# EasyEDA Pro project 无刷电调_V3.1.epro, board 无刷电调_V3.1
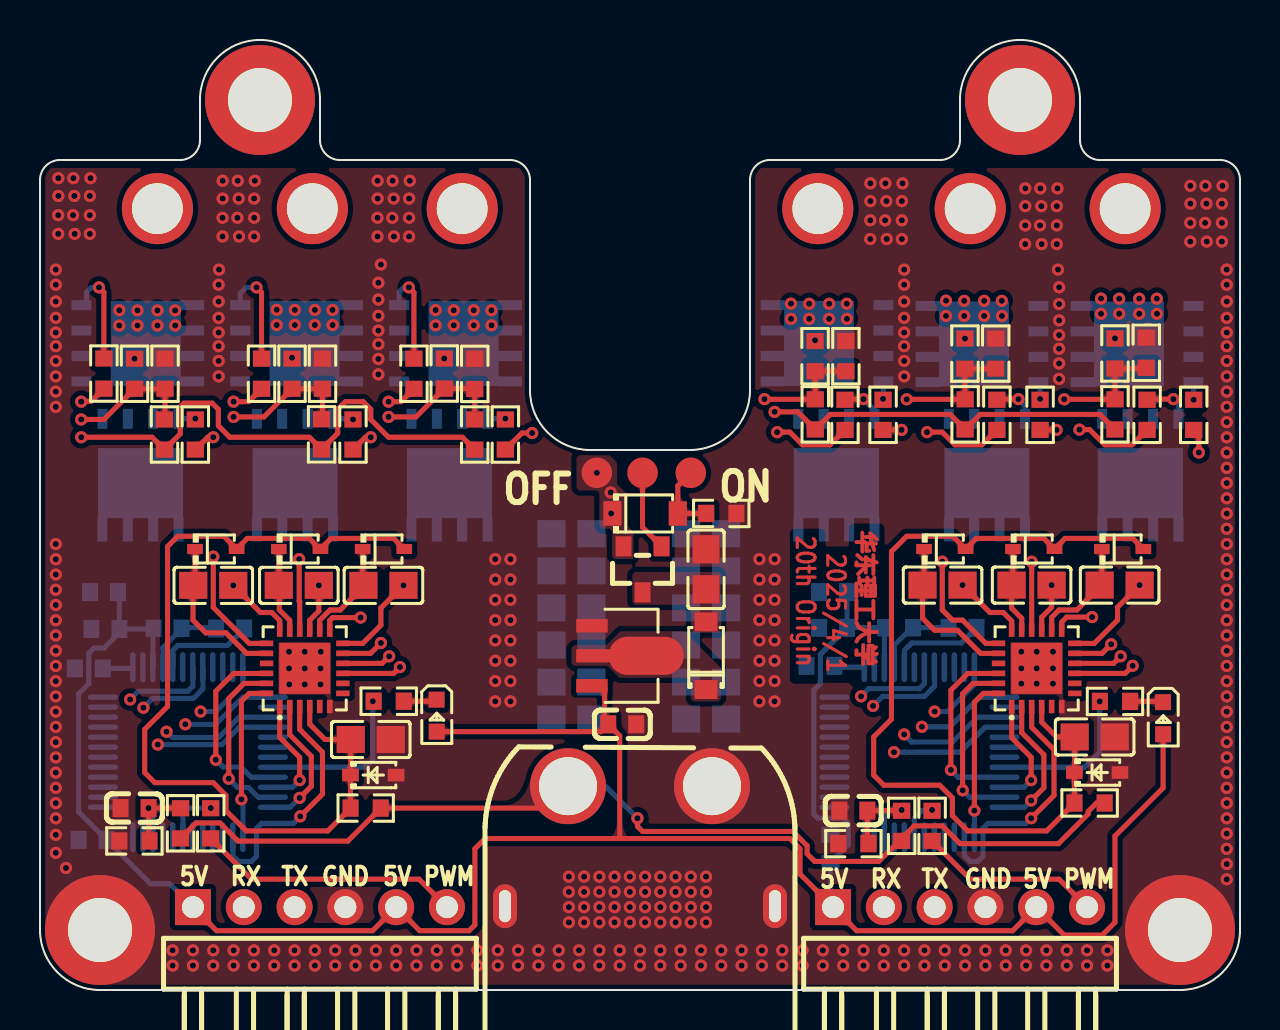
[diagram p4: board, top side]
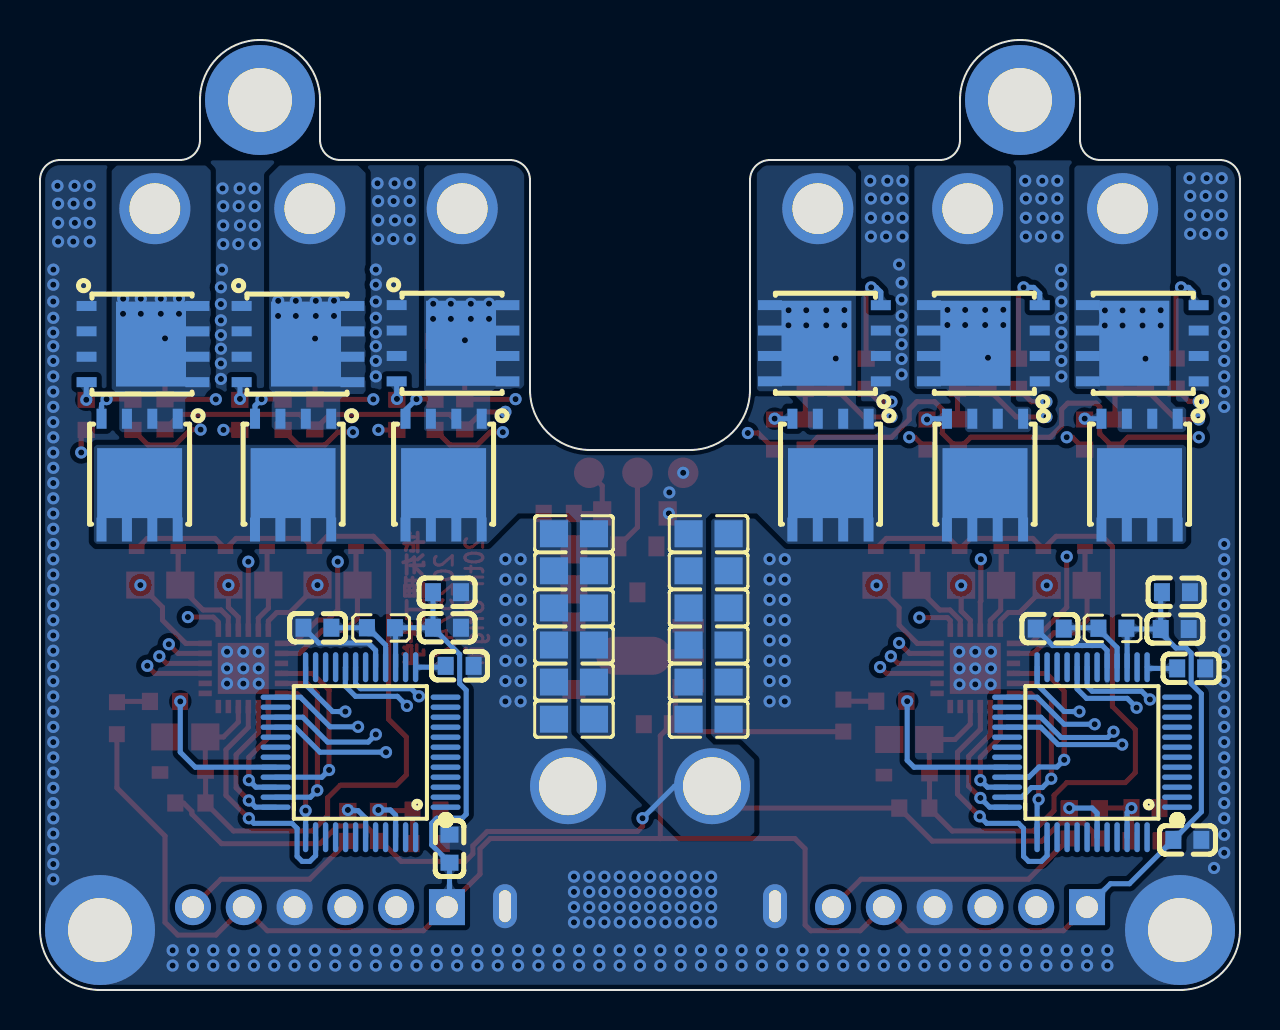
[diagram p5: board, bottom side, seen from below]

Outline 60 x 47.5 mm; copper layers: Top Layer, Inner1, Inner2, Bottom Layer. Coordinates in mm from the lower left corner of the outline.
Outline path: 0,40.5 0,3 arc(0.88,0.88) 3,0 57,0 arc(59.12,0.88) 60,3 60,40.5 arc(59.71,41.21) 59,41.5 53,41.5 arc(52.29,41.79) 52,42.5 52,44.51 arc(51.12,46.62) 49.01,47.5 48.99,47.5 arc(46.88,46.62) 46,44.51 46,42.5 arc(45.71,41.79) 45,41.5 36.5,41.5 arc(35.79,41.21) 35.5,40.5 35.5,30 arc(34.62,27.88) 32.5,27 27.5,27 arc(25.38,27.88) 24.5,30 24.5,40.5 arc(24.21,41.21) 23.5,41.5 15,41.5 arc(14.29,41.79) 14,42.5 14,44.51 arc(13.12,46.62) 11.01,47.5 10.99,47.5 arc(8.88,46.62) 8,44.51 8,42.5 arc(7.71,41.79) 7,41.5 1,41.5 arc(0.29,41.21) 0,40.5
Stack: Top Layer 0.035mm 外层铜厚1oz / Dielectric1 0.2104mm 7628 RC49% 8.6mil / Inner1 0.0152mm 内层铜厚 / Dielectric2 1.065mm 1.1mm H/HOZ Copper / Inner2 0.0152mm 内层铜厚 / Dielectric3 0.2104mm 7628 RC49% 8.6mil / Bottom Layer 0.035mm 外层铜厚1oz

## Design rules (mm)
template: 4层
spacing copperThickness1oz (default): track to track 0.102, other pairs 0.152 to 0.3
spacing copperThickness2oz: track to track 0.203, other pairs 0.152 to 0.3
spacing copperThicknessInner0.5oz: track to track 0.089, other pairs 0.152 to 0.3
spacing 板框0间距: track to track 0.152, other pairs 0 to 0.3
track width copperThickness1oz (default): min 0.102, default 0.254, max 2.54
track width copperThickness2oz: min 0.203, default 0.254, max 2.54
track width copperThickness0.5oz: min 0.089, default 0.254, max 2.54
differential pair differentialPair (default): width min 0.127, default 0.254, max 2.54; gap min 0.152, default 0.152
via viaSize (default): diameter min 0.3, default 0.61, max 10; hole min 0.2, default 0.305, max 6.3
region e112 uses copperRegion, copperThickness1oz, differentialPair, innerPlane, otherClearance, viaSize, 板框0间距
region e113 uses copperRegion, copperThickness1oz, differentialPair, innerPlane, otherClearance, viaSize, 板框0间距
region e114 uses 板框0间距
region e115 uses 板框0间距

## Placement (name value [footprint] x y rotation side)
C1  100nF  [C0603]  2.44 16.08 180 bottom
C2  10uF  [C0603]  2.63 7.51 0 bottom
C3  100nF  [C0603]  3.2 19.89 0 bottom
C4  100nF  [C0603]  9.51 18.07 0 bottom
C5  100nF  [C0603]  4.73 9.1 0 top
C6  22uF  [C0805]  26.57 13.54 0 bottom
C7  22uF  [C0805]  26.57 15.39 0 bottom
C8  22uF  [C0805]  26.57 17.25 0 bottom
C9  22uF  [C0805]  26.57 19.1 0 bottom
C10  22uF  [C0805]  26.57 22.81 0 bottom
C11  22uF  [C0805]  26.57 20.96 0 bottom
C12  22uF  [C0805]  33.3 21.03 270 top
C13  10uF  [C0603]  29.11 13.29 180 top
C14  100nF  [C0603]  3.27 18.05 0 bottom
C15  22uF  [C0805]  16.54 12.53 0 top
C16  4.7uF  [C0805]  8.66 20.23 0 top
C17  4.7uF  [C0805]  12.94 20.23 0 top
C18  4.7uF  [C0805]  17.17 20.23 0 top
C19  100nF  [C0603]  39.02 16.21 180 bottom
C20  10uF  [C0603]  39.65 18.11 0 bottom
C21  100nF  [C0603]  39.65 19.89 0 bottom
C22  100nF  [C0603]  46.13 18.11 0 bottom
C23  100nF  [C0603]  40.67 8.97 0 top
C24  22uF  [C0805]  33.3 13.54 180 bottom
C25  22uF  [C0805]  33.3 22.81 180 bottom
C26  22uF  [C0805]  33.3 20.96 180 bottom
C27  22uF  [C0805]  33.3 19.1 180 bottom
C28  22uF  [C0805]  33.3 17.25 180 bottom
C29  22uF  [C0805]  33.3 15.39 180 bottom
C33  22uF  [C0805]  52.73 12.65 0 top
C34  4.7uF  [C0805]  45.13 20.25 0 top
C35  4.7uF  [C0805]  49.58 20.25 0 top
C36  4.7uF  [C0805]  53.98 20.25 0 top
C37  100nF  [C0603]  39.53 7.06 270 bottom
CN1  XT60PW-M  [CONN-TH_XT60PW-M]  30 7.19 90 top
D1  BZT52C15S  [SOD-323_L1.7-W1.3-LS2.6-RD]  16.66 10.75 0 top
D2  B5819WS  [SOD-323_L1.7-W1.3-LS2.5-FD]  8.79 22.05 180 top
D3  B5819WS  [SOD-323_L1.7-W1.3-LS2.5-FD]  12.98 22.05 180 top
D4  B5819WS  [SOD-323_L1.7-W1.3-LS2.5-FD]  17.17 22.05 180 top
D5  DSK34  [SOD-123_L2.8-W1.8-LS3.7-RD]  33.3 16.72 90 top
D6  BZT52C15S  [SOD-323_L1.7-W1.3-LS2.6-RD]  52.86 10.87 0 top
D7  B5819WS  [SOD-323_L1.7-W1.3-LS2.5-FD]  45.24 22.05 180 top
D8  B5819WS  [SOD-323_L1.7-W1.3-LS2.5-FD]  49.69 22.05 180 top
D9  B5819WS  [SOD-323_L1.7-W1.3-LS2.5-FD]  54.13 22.05 180 top
D10  BZT52C16  [SOD-123_L2.7-W1.6-LS3.7-RD]  30.25 23.83 0 top
H1  PZ254R-11-06P  [HDR-TH_6P-P2.54-H-M-W10.4]  14 4.14 0 top
H3  PZ254R-11-06P  [HDR-TH_6P-P2.54-H-M-W10.4]  46 4.14 0 top
L1  CBG160808U000T  [L0603]  6.38 18.09 0 bottom
L2  CBG160808U000T  [L0603]  42.95 18.11 0 bottom
LED1  -  [LED_0603]  19.84 13.67 270 top
LED2  -  [LED_0603]  56.16 13.54 270 top
NOREF  -  [Pad_e760]  21.11 39.07 0 top
NOREF#2  -  [Pad_e761]  38.89 39.07 0 top
NOREF#3  -  [Pad_e34]  30.13 25.86 0 top
NOREF#4  -  [Pad_e757]  5.87 39.07 0 top
NOREF#5  -  [Pad_e763]  54.26 39.07 0 top
NOREF#6  -  [Pad_e762]  46.51 39.07 0 top
NOREF#7  -  [Pad_e131]  32.54 25.86 0 top
NOREF#8  -  [Pad_e759]  13.62 39.07 0 top
NOREF#9  -  [Pad_e130]  27.84 25.86 0 top
Q1  TPH1R403NL  [DSOP-8_L5.0-W5.0-P1.27-LS6.0-BL-EP]  5.02 25.79 0 bottom
Q2  TPH1R403NL  [DSOP-8_L5.0-W5.0-P1.27-LS6.0-BL-EP]  4.84 32.34 90 bottom
Q3  TPH1R403NL  [DSOP-8_L5.0-W5.0-P1.27-LS6.0-BL-EP]  12.75 25.79 0 bottom
Q4  TPH1R403NL  [DSOP-8_L5.0-W5.0-P1.27-LS6.0-BL-EP]  12.78 32.34 90 bottom
Q5  TPH1R403NL  [DSOP-8_L5.0-W5.0-P1.27-LS6.0-BL-EP]  20.47 25.79 0 bottom
Q6  TPH1R403NL  [DSOP-8_L5.0-W5.0-P1.27-LS6.0-BL-EP]  20.73 32.34 90 bottom
Q7  TPH1R403NL  [DSOP-8_L5.0-W5.0-P1.27-LS6.0-BL-EP]  39.82 25.79 0 bottom
Q8  TPH1R403NL  [DSOP-8_L5.0-W5.0-P1.27-LS6.0-BL-EP]  39.4 32.34 270 bottom
Q9  TPH1R403NL  [DSOP-8_L5.0-W5.0-P1.27-LS6.0-BL-EP]  47.34 25.79 0 bottom
Q10  TPH1R403NL  [DSOP-8_L5.0-W5.0-P1.27-LS6.0-BL-EP]  47.15 32.3 270 bottom
Q11  TPH1R403NL  [DSOP-8_L5.0-W5.0-P1.27-LS6.0-BL-EP]  55.02 25.79 0 bottom
Q12  TPH1R403NL  [DSOP-8_L5.0-W5.0-P1.27-LS6.0-BL-EP]  54.9 32.3 270 bottom
Q13  -  [AO3401A_SOT-23-3]  30.13 21.03 90 top
R2  5.1K  [R0603]  4.73 30.81 90 top
R3  1K  [R0603]  6.22 27.77 270 top
R4  5.1K  [R0603]  12.6 30.81 90 top
R5  1K  [R0603]  14.08 27.78 270 top
R6  5.1K  [R0603]  20.21 30.82 90 top
R7  1K  [R0603]  21.74 27.77 270 top
R8  1K  [R0603]  6.25 30.81 270 top
R9  1K  [R0603]  14.12 30.81 270 top
R10  1K  [R0603]  21.74 30.8 270 top
R11  47K  [R0603]  7.03 8.33 270 top
R12  10K  [R0603]  4.72 7.45 0 top
R13  100R  [R0603]  8.54 8.33 270 top
R14  10K  [R0603]  17.44 14.44 180 top
R15  100R  [R0603]  16.28 9.1 180 top
R16  4.7R  [R0603]  7.77 27.77 90 top
R17  4.7R  [R0603]  3.19 30.82 90 top
R18  4.7R  [R0603]  15.65 27.77 90 top
R19  4.7R  [R0603]  11.08 30.81 90 top
R20  4.7R  [R0603]  23.27 27.77 90 top
R21  4.7R  [R0603]  18.7 30.81 90 top
R22  5.1K  [R0603]  38.75 31.69 90 top
R23  1K  [R0603]  38.76 28.78 270 top
R24  5.1K  [R0603]  46.25 31.82 90 top
R25  1K  [R0603]  46.26 28.78 270 top
R26  5.1K  [R0603]  53.75 31.83 90 top
R27  1K  [R0603]  53.75 28.78 270 top
R28  1K  [R0603]  40.3 31.69 270 top
R29  1K  [R0603]  47.79 31.82 270 top
R30  1K  [R0603]  55.32 31.86 270 top
R31  47K  [R0603]  43.08 8.21 270 top
R32  10K  [R0603]  40.67 7.32 0 top
R34  10K  [R0603]  53.75 14.43 180 top
R35  100R  [R0603]  52.48 9.35 180 top
R36  4.7R  [R0603]  40.25 28.76 90 top
R37  4.7R  [R0603]  42.15 28.76 90 top
R38  4.7R  [R0603]  47.84 28.76 90 top
R39  4.7R  [R0603]  50 28.76 90 top
R40  4.7R  [R0603]  55.35 28.76 90 top
R41  4.7R  [R0603]  57.69 28.76 90 top
R42  100R  [R0603]  44.6 8.21 270 top
R43  10K  [R0603]  34.06 23.83 180 top
U15  STC32G12K128-35I-LQFP48  [LQFP-48_L7.0-W7.0-P0.50-LS9.0-BL]  7.39 11.89 90 bottom
U16  SE8650K2-HF  [SOT-89-3_L4.5-W2.5-P1.50-LS4.2-BR]  28.95 16.71 180 top
U17  FD6288Q  [QFN-24_L4.0-W4.0-P0.50-BL-EP2.6]  13.24 16.08 0 top
U18  -  [M3螺丝孔]  57 3 0 top
U19  -  [M3螺丝孔]  3 3 0 top
U20  -  [M3螺丝孔]  11 44.5 0 top
U21  -  [M3螺丝孔]  49 44.5 0 top
U22  STC32G12K128-35I-LQFP48  [LQFP-48_L7.0-W7.0-P0.50-LS9.0-BL]  43.97 11.89 90 bottom
U28  FD6288Q  [QFN-24_L4.0-W4.0-P0.50-BL-EP2.6]  49.83 16.08 0 top

## Footprints (pads in the part's own frame, mm; a bottom-side part is the same pattern mirrored in y, then rotated)
AO3401A_SOT-23-3
  rect 1x0.8 smd: 1(1.15,-0.95) 2(1.15,0.95) 3(-1.15,0)
C0603
  rect 0.8x0.9 smd: 1(-0.7,0) 2(0.7,0)
C0805
  rect 1.41x1.35 smd: 1(-1,0) 2(1,0)
CONN-TH_XT60PW-M
  round 3.8 hole 2.9: 1(3,-3.6) 2(3,3.6)
  oval 2.2x1.2 hole 1.6x0.6: 3(-3,6.75) 4(-3,-6.75)
DSOP-8_L5.0-W5.0-P1.27-LS6.0-BL-EP
  rect 0.5x1 smd: 1(-1.905,-2.77) 2(-0.635,-2.77) 3(0.634,-2.77) 4(1.905,-2.77)
  rect 0.5x1.2 smd: 5(1.905,2.77) 6(0.635,2.77) 7(-0.634,2.77) 8(-1.905,2.77)
  custom 4.25x3.5 smd: 9(0,0.45)
HDR-TH_6P-P2.54-H-M-W10.4
  rect 1.8x1.8 hole 1.1: 1(-6.35,0)
  round 1.8 hole 1.1: 2(-3.81,0) 3(-1.27,0) 4(1.27,0) 5(3.81,0) 6(6.35,0)
L0603
  rect 0.8x0.864 smd: 1(-0.7,0) 2(0.7,0)
LED_0603
  rect 0.8x0.8 smd: 1(-0.851,-0.01) 2(0.75,-0.005)
LQFP-48_L7.0-W7.0-P0.50-LS9.0-BL
  oval 0.27x1.5 smd: 1(-2.75,-4.25) 2(-2.25,-4.25) 3(-1.75,-4.25) 4(-1.25,-4.25) 5(-0.75,-4.25) 6(-0.25,-4.25) 7(0.25,-4.25) 8(0.75,-4.25) 9(1.25,-4.25) 10(1.75,-4.25) 11(2.25,-4.25) 12(2.75,-4.25) 25(2.75,4.25) 26(2.25,4.25) 27(1.75,4.25) 28(1.25,4.25) 29(0.75,4.25) 30(0.25,4.25) 31(-0.25,4.25) 32(-0.75,4.25) 33(-1.25,4.25) 34(-1.75,4.25) 35(-2.25,4.25) 36(-2.75,4.25)
  oval 1.5x0.27 smd: 13(4.25,-2.75) 14(4.25,-2.25) 15(4.25,-1.75) 16(4.25,-1.25) 17(4.25,-0.75) 18(4.25,-0.25) 19(4.25,0.25) 20(4.25,0.75) 21(4.25,1.25) 22(4.25,1.75) 23(4.25,2.25) 24(4.25,2.75) 37(-4.25,2.75) 38(-4.25,2.25) 39(-4.25,1.75) 40(-4.25,1.25) 41(-4.25,0.75) 42(-4.25,0.25) 43(-4.25,-0.25) 44(-4.25,-0.75) 45(-4.25,-1.25) 46(-4.25,-1.75) 47(-4.25,-2.25) 48(-4.25,-2.75)
M3螺丝孔
  round 5.5 hole 3.2: 1(0,0)
Pad_e34
  round 1.524 smd: 1(0,0)
Pad_e130
  round 1.524 smd: 1(0,0)
Pad_e131
  round 1.524 smd: 1(0,0)
Pad_e757
  round 3.556 hole 2.54: 1(0,0)
Pad_e759
  round 3.556 hole 2.54: 1(0,0)
Pad_e760
  round 3.556 hole 2.54: 1(0,0)
Pad_e761
  round 3.556 hole 2.54: 1(0,0)
Pad_e762
  round 3.556 hole 2.54: 1(0,0)
Pad_e763
  round 3.556 hole 2.54: 1(0,0)
QFN-24_L4.0-W4.0-P0.50-BL-EP2.6
  rect 0.28x0.665 smd: 1(-1.25,-1.907) 2(-0.75,-1.907) 3(-0.25,-1.907) 4(0.25,-1.907) 5(0.75,-1.907) 6(1.25,-1.907) 13(1.25,1.907) 14(0.75,1.907) 15(0.25,1.907) 16(-0.25,1.907) 17(-0.75,1.907) 18(-1.25,1.907)
  rect 0.665x0.28 smd: 7(1.907,-1.25) 8(1.907,-0.75) 9(1.907,-0.25) 10(1.907,0.25) 11(1.907,0.75) 12(1.907,1.25) 19(-1.907,1.25) 20(-1.907,0.75) 21(-1.907,0.25) 22(-1.907,-0.25) 23(-1.907,-0.75) 24(-1.907,-1.25)
  rect 2.55x2.55 smd: 25(0,0)
R0603
  rect 0.806x0.864 smd: 1(-0.753,0) 2(0.753,0)
SOD-123_L2.7-W1.6-LS3.7-RD
  rect 0.91x1.22 smd: 1(-1.635,0) 2(1.635,0)
SOD-123_L2.8-W1.8-LS3.7-RD
  rect 0.95x1.15 smd: 1(-1.692,0) 2(1.692,0)
SOD-323_L1.7-W1.3-LS2.5-FD
  rect 0.78x0.5 smd: 1(-1.04,0) 2(1.04,0)
SOD-323_L1.7-W1.3-LS2.6-RD
  rect 0.83x0.63 smd: 1(-1.14,0) 2(1.14,0)
SOT-89-3_L4.5-W2.5-P1.50-LS4.2-BR
  rect 1.575x0.672 smd: 1(1.356,-1.5) 3(1.356,1.5)
  custom 5.377x1.9 smd: 2(-1.356,0)

## Nets
As in the schematic, except:
VBAT: C6.2 C7.2 C8.2 C9.2 C10.2 C11.2 C24.2 C25.2 C26.2 C27.2 C28.2 C29.2 CN1.2 D10.1 NOREF#9.1 Q1.5 Q1.6 Q1.7 Q1.8 Q1.9 Q3.5 Q3.6 Q3.7 Q3.8 Q3.9 Q5.5 Q5.6 Q5.7 Q5.8 Q5.9 Q7.5 Q7.6 Q7.7 Q7.8 Q7.9 Q9.5 Q9.6 Q9.7 Q9.8 Q9.9 Q11.5 Q11.6 Q11.7 Q11.8 Q11.9 Q13.2 R11.2 R15.1 R31.2 R35.1
DOWN: D10.2 NOREF#7.1 R43.2
GATE: NOREF#3.1 Q13.1
VSA1: C16.2 NOREF#4.1 Q1.1 Q1.2 Q1.3 Q2.5 Q2.6 Q2.7 Q2.8 Q2.9 R2.2 U17.18
VSA2: C34.2 NOREF#2.1 Q7.1 Q7.2 Q7.3 Q8.5 Q8.6 Q8.7 Q8.8 Q8.9 R22.2 U28.18
VSB1: C17.2 NOREF#8.1 Q3.1 Q3.2 Q3.3 Q4.5 Q4.6 Q4.7 Q4.8 Q4.9 R4.2 U17.15
VSB2: C35.2 NOREF#6.1 Q9.1 Q9.2 Q9.3 Q10.5 Q10.6 Q10.7 Q10.8 Q10.9 R24.2 U28.15
VSC1: C18.2 NOREF.1 Q5.1 Q5.2 Q5.3 Q6.5 Q6.6 Q6.7 Q6.8 Q6.9 R6.2 U17.12
VSC2: C36.2 NOREF#5.1 Q11.1 Q11.2 Q11.3 Q12.5 Q12.6 Q12.7 Q12.8 Q12.9 R26.2 U28.12

Pads without a net: U15 1 2 3 4 5 6 7 8 9 10 11 12 14 18 21 22 23 26 29 30 31 39 40 41 42 44 45 47 48; U17 5 7 8 21; U20 1; U21 1; U22 1 2 3 4 5 6 7 8 9 10 11 12 14 18 21 22 23 26 29 30 31 39 40 41 42 44 45 47 48; U28 5 7 8 21

## Via types
v1: diameter 0.61, hole 0.305, Top Layer to Bottom Layer, 499 vias

## Routing (per net, layer and track width the routed paths; a pad name or vN(x,y) marks a point on that pad's centre or on a via; arc(x,y) is an arc through that point)
GND: length 9.8
  Bottom Layer w0.254: C4.2 9.37,17.22 6.89,17.22 6.64,16.98 U15.17 ; C22.2 46.07,17.35 43.59,17.35 43.22,16.98 U22.17
  vias: v1(0.79,36.02) v1(0.79,35.26) v1(0.79,34.42) v1(0.79,33.61) v1(0.79,32.87) v1(0.79,32.19) v1(0.79,31.45) v1(0.79,30.68) v1(0.79,29.92) v1(0.79,29.16) v1(0.79,22.3) v1(0.79,21.54) v1(0.79,20.77) v1(0.79,20.01) v1(0.79,19.25) v1(0.79,18.49) v1(0.79,17.73) v1(0.79,16.96) v1(0.79,16.2) v1(0.79,15.44) v1(0.79,14.68) v1(0.79,13.92) v1(0.79,13.15) v1(0.79,12.39) v1(0.79,11.63) v1(0.79,10.87) v1(0.79,10.11) v1(0.79,9.34) v1(0.79,8.58) v1(0.79,7.76) v1(0.79,6.86) v1(0.92,40.59) v1(0.92,39.7) v1(0.91,38.74) v1(0.91,37.81) v1(1.3,6.1) v1(1.67,40.59) v1(1.72,39.7) v1(1.65,38.74) v1(1.73,37.81) v1(2.52,40.59) v1(2.49,39.7) v1(2.49,38.74) v1(2.49,37.81) v1(6.63,1.98) v1(6.63,1.22) v1(7.65,1.98) v1(7.65,1.22) v1(8.66,1.98) v1(8.66,1.22) v1(8.93,35.26) v1(8.93,34.42) v1(8.93,33.61) v1(8.93,32.87) v1(8.93,32.19) v1(8.93,31.45) v1(8.93,30.68) v1(8.95,36.02) v1(9.13,40.46) v1(9.13,39.57) v1(9.13,38.61) v1(9.13,37.67) v1(9.68,1.98) v1(9.68,1.22) v1(9.89,40.46) v1(9.93,39.57) v1(9.87,38.61) v1(9.95,37.67) v1(10.74,40.46) v1(10.71,39.57) v1(10.71,38.61) v1(10.71,37.67) v1(10.7,1.98) v1(10.7,1.22) v1(11.71,1.98) v1(11.71,1.22) v1(12.45,16.91) v1(12.45,16.08) v1(12.46,15.28) v1(12.73,1.98) v1(12.73,1.22) v1(13.24,16.91) v1(13.24,16.08) v1(13.24,15.28) v1(13.74,1.98) v1(13.74,1.22) v1(14.04,16.91) v1(14.03,16.08) v1(14.03,15.28) v1(14.76,1.98) v1(14.76,1.22) v1(15.78,1.98) v1(15.78,1.22) v1(16.79,1.98) v1(16.79,1.22) v1(16.88,40.46) v1(16.88,39.57) v1(16.87,38.61) v1(16.87,37.67) v1(16.92,35.36) v1(16.92,34.52) v1(16.92,33.71) v1(16.92,32.97) v1(16.92,32.29) v1(16.92,31.55) v1(16.92,30.78) v1(17.05,36.27) v1(17.63,40.46) v1(17.62,38.61) v1(17.68,39.57) v1(17.7,37.67) v1(17.81,1.98) v1(17.81,1.22) v1(18.49,40.46) v1(18.46,39.57) v1(18.46,38.61) v1(18.46,37.67) v1(18.82,1.98) v1(18.82,1.22) v1(19.84,1.98) v1(19.84,1.22) v1(20.86,1.98) v1(20.86,1.22) v1(21.87,1.98) v1(21.87,1.22) v1(22.76,21.54) v1(22.76,20.53) v1(22.76,19.51) v1(22.76,18.49) v1(22.76,17.48) v1(22.76,16.46) v1(22.76,15.45) v1(22.76,14.43) v1(22.89,1.98) v1(22.89,1.22) v1(23.52,21.54) v1(23.52,20.53) v1(23.52,19.51) v1(23.52,18.49) v1(23.52,17.48) v1(23.52,16.46) v1(23.52,15.45) v1(23.52,14.43) v1(23.9,1.98) v1(23.9,1.22) v1(24.92,1.98) v1(24.92,1.22) v1(25.94,1.98) v1(25.94,1.22) v1(26.44,5.67) v1(26.44,4.91) v1(26.44,4.14) v1(26.44,3.38) v1(26.95,1.98) v1(26.95,1.22) v1(27.21,5.67) v1(27.21,4.91) v1(27.21,4.14) v1(27.21,3.38) v1(27.97,5.67) v1(27.97,4.91) v1(27.97,4.14) v1(27.97,3.38) v1(27.97,1.98) v1(27.97,1.22) v1(28.73,5.67) v1(28.73,4.91) v1(28.73,4.14) v1(28.73,3.38) v1(28.98,1.98) v1(28.98,1.22) v1(29.49,5.67) v1(29.49,4.91) v1(29.49,4.14) v1(29.49,3.38) v1(30,1.98) v1(30,1.22) v1(30.25,5.67) v1(30.25,4.91) v1(30.25,4.14) v1(30.25,3.38) v1(31.02,5.67) v1(31.02,4.91) v1(31.02,4.14) v1(31.02,3.38) v1(31.02,1.98) v1(31.02,1.22) v1(31.78,5.67) v1(31.78,4.91) v1(31.78,4.14) v1(31.78,3.38) v1(32.03,1.98) v1(32.03,1.22) v1(32.54,5.67) v1(32.54,4.91) v1(32.54,4.14) v1(32.54,3.38) v1(33.05,1.98) v1(33.05,1.22) v1(33.3,5.67) v1(33.3,4.91) v1(33.3,4.14) v1(33.3,3.38) v1(34.06,1.98) v1(34.06,1.22) v1(35.08,1.98) v1(35.08,1.22) v1(35.97,21.54) v1(35.97,20.53) v1(35.97,19.51) v1(35.97,18.49) v1(35.97,17.48) v1(35.97,16.46) v1(35.97,15.45) v1(35.97,14.43) v1(36.1,1.98) v1(36.1,1.22) v1(36.73,21.54) v1(36.73,20.53) v1(36.73,19.51) v1(36.73,18.49) v1(36.73,17.48) v1(36.73,16.46) v1(36.73,15.45) v1(36.73,14.43) v1(37.11,1.98) v1(37.11,1.22) v1(38.13,1.98) v1(38.13,1.22) v1(39.14,1.98) v1(39.14,1.22) v1(40.16,1.98) v1(40.16,1.22) v1(41.18,1.98) v1(41.18,1.22) v1(41.52,40.33) v1(41.52,39.44) v1(41.51,38.48) v1(41.51,37.55) v1(42.19,1.98) v1(42.19,1.22) v1(42.27,40.33) v1(42.32,39.44) v1(42.25,38.48) v1(42.34,37.55) v1(43.13,40.33) v1(43.09,39.44) v1(43.09,38.48) v1(43.09,37.55) v1(43.21,36.02) v1(43.21,35.26) v1(43.21,34.42) v1(43.21,33.61) v1(43.21,32.87) v1(43.21,32.19) v1(43.21,31.45) v1(43.21,30.68) v1(43.21,1.98) v1(43.21,1.22) v1(44.22,1.98) v1(44.22,1.22) v1(45.24,1.98) v1(45.24,1.22) v1(46.26,1.98) v1(46.26,1.22) v1(47.27,1.98) v1(47.27,1.22) v1(48.29,1.98) v1(48.29,1.22) v1(49.07,16.91) v1(49.07,16.08) v1(49.07,15.32) v1(49.27,40.08) v1(49.27,39.19) v1(49.26,38.23) v1(49.26,37.29) v1(49.3,1.98) v1(49.3,1.22) v1(49.83,16.91) v1(49.83,16.08) v1(49.83,15.32) v1(50.02,40.08) v1(50,38.23) v1(50.07,39.19) v1(50.08,37.29) v1(50.32,1.98) v1(50.32,1.22) v1(50.65,16.91) v1(50.65,16.08) v1(50.65,15.32) v1(50.84,39.19) v1(50.84,38.23) v1(50.84,37.29) v1(50.87,40.08) v1(50.9,36.02) v1(50.96,35.14) v1(50.96,34.3) v1(50.96,33.48) v1(50.96,32.75) v1(50.96,32.06) v1(50.96,31.33) v1(50.96,30.55) v1(51.34,1.98) v1(51.34,1.22) v1(52.35,1.98) v1(52.35,1.22) v1(53.37,1.98) v1(53.37,1.22) v1(57.52,40.21) v1(57.52,39.32) v1(57.51,38.36) v1(57.51,37.42) v1(58.27,40.21) v1(58.32,39.32) v1(58.26,38.36) v1(58.34,37.42) v1(59.13,40.21) v1(59.09,39.32) v1(59.09,38.36) v1(59.09,37.42) v1(59.33,36.02) v1(59.34,35.26) v1(59.34,34.42) v1(59.34,33.61) v1(59.34,32.87) v1(59.34,32.19) v1(59.34,31.45) v1(59.34,30.68) v1(59.34,29.92) v1(59.34,29.16) v1(59.34,28.39) v1(59.34,27.63) v1(59.34,26.87) v1(59.34,26.11) v1(59.34,25.35) v1(59.34,24.58) v1(59.34,23.82) v1(59.34,23.06) v1(59.34,22.3) v1(59.34,21.54) v1(59.34,20.77) v1(59.34,20.01) v1(59.34,19.25) v1(59.34,18.49) v1(59.34,17.73) v1(59.34,16.96) v1(59.34,16.2) v1(59.34,15.44) v1(59.34,14.68) v1(59.34,13.92) v1(59.34,13.15) v1(59.34,12.39) v1(59.34,11.63) v1(59.34,10.87) v1(59.34,10.11) v1(59.34,9.34) v1(59.34,8.58) v1(59.34,7.82) v1(59.34,7.06) v1(59.34,6.3) v1(59.34,5.53)
VBAT: length 52.1
  Top Layer w0.254: CN1.2 25.31,9.1 R15.1 15.39,7.44 9.9,7.44 8.99,8.35 7.8,8.35 R11.2 ; v1(29.87,8.59) 29.87,8.18 30.13,7.93 37.64,7.93 38.36,7.21 38.36,6.81 38.74,6.43 41.94,6.43 43.72,8.21 45.11,8.21 46,7.32 50.92,7.32 52.41,8.8 52.41,8.93 52.83,9.35 R35.1
  Bottom Layer w0.254: v1(29.87,8.59) 28.27,10.19 CN1.2
  vias: v1(27.84,25.86) v1(28.53,24.88) v1(28.56,23.83)
VCC5V: length 128.5
  Top Layer w0.254: C13.2 28.23,13.47 28.23,15.21 ; C13.2 28.98,12.71 28.98,7.57 ; C13.2 28.04,12.92 LED1.2 ; H1.1 8.83,2.96 16.63,2.96 H1.5 18.99,2.96 21.46,2.96 21.75,3.25 21.75,7.06 22.25,7.57 28.98,7.57 ; 28.98,7.57 37.49,7.57 38,7.06 38,5.79 H3.1 40.83,2.96 48.63,2.96 H3.5 51.21,2.75 53.11,2.75 53.75,3.38 53.75,7.7 56.16,10.11 LED2.2
  Bottom Layer w0.254: H1.1 6.48,5.31 5.53,5.31 C2.2 1.93,8.91 1.93,14.81 2.44,15.32 2.44,16.84 2.69,17.1 3.2,17.1 3.97,17.86 C14.2 5.77,18.05 5.64,17.92 U15.15 ; 3.97,18.18 3.97,19.83 C3.2 ; C20.2 39.02,16.78 39.02,15.32 38.69,14.99 38.69,8.79 38.89,8.59 40.16,8.59 40.41,8.33 40.41,7.25 C37.2 39.53,4.27 H3.1 ; C20.2 L2.1 42.22,18.08 U22.15 ; C20.2 C21.2
ABMF1: length 32.2
  Top Layer w0.254: R3.1 6.25,28.55 R8.2 R2.1 3.19,28.53 v1(2.06,28.53)
  Inner2 w0.254: v1(2.06,28.53) 1.3,27.77 1.3,23.95 3.2,22.05 3.2,12.91 3.84,12.27 v1(5.89,12.27)
  Bottom Layer w0.254: U15.28 9.96,13.14 9.09,12.27 v1(5.89,12.27)
ABMF2: length 32.4
  Top Layer w0.254: v1(36.22,29.54) 36.23,29.53 R23.1 38.76,30.93 R22.1 R28.2
  Inner2 w0.254: v1(36.22,29.54) 35.84,29.16 35.84,28.65 35.59,28.4 35.59,26.08 37.24,24.43 37.24,22.94 39.97,20.21 39.97,14.62 v1(42.7,11.89)
  Bottom Layer w0.254: v1(42.7,11.89) 46,11.89 47.25,13.14 U22.28
BATADC1: length 4.8
  Top Layer w0.254: R12.2 5.43,7.5 v1(5.43,9.1) 7.02,9.1 R11.1
  Bottom Layer w0.254: v1(5.43,9.1) 5.64,8.88 U15.46
BATADC2: length 5.5
  Top Layer w0.254: R32.2 41.37,7.37 C23.2 43.07,8.97 R31.1
  Bottom Layer w0.254: U22.46 42.22,8.74 42.48,9 v1(43.08,9)
BBMF1: length 31.1
  Top Layer w0.254: R5.1 14.12,28.58 R9.2 R4.1 11.2,28.65 v1(9.68,28.65)
  Inner2 w0.254: v1(7.27,13.29) 6.38,14.18 6.38,18.24 7.01,18.88 9.81,18.88 10.44,19.51 10.44,23.95 9.43,24.97 9.43,28.4 v1(9.68,28.65)
  Bottom Layer w0.254: v1(7.27,13.29) 8.79,13.29 10.14,14.64 U15.25
BBMF2: length 34.7
  Top Layer w0.254: R29.2 R24.1 46.25,29.54 R25.1 v1(43.34,29.53)
  Inner2 w0.254: v1(44.1,13.16) 43.34,13.92 43.34,18.75 43.97,19.38 46.51,19.38 47.15,20.02 47.15,22.56 46.06,23.64 42.89,23.64 42.45,24.08 42.45,28.65 v1(43.34,29.53)
  Bottom Layer w0.254: U22.25 46.97,14.64 45.49,13.16 v1(44.1,13.16)
CBMF1: length 32.6
  Top Layer w0.254: R7.1 R10.2 21.72,30.07 R6.1 18.8,28.65 v1(17.43,28.65)
  Inner2 w0.254: v1(17.43,28.65) 17.17,28.4 17.17,21.67 13.62,18.11 7.78,18.11 7.27,17.61 7.27,14.68 v1(8.03,13.92)
  Bottom Layer w0.254: v1(8.03,13.92) 8.79,13.92 10.14,15.28 U15.24
CBMF2: length 32.8
  Top Layer w0.254: v1(51.21,29.53) R27.1 R26.1 55.28,31.08 R30.2
  Inner2 w0.254: v1(44.73,13.92) 43.97,14.68 43.97,18.11 44.6,18.75 50.83,18.75 51.59,19.51 51.59,21.92 51.08,22.43 51.08,25.22 50.19,26.11 50.19,28.52 v1(51.21,29.53)
  Bottom Layer w0.254: U22.24 46.72,15.28 45.37,13.92 v1(44.73,13.92)
DOWN: length 3.7
  Top Layer w0.254: R43.2 D10.2 31.89,25.21 NOREF#7.1
GATE: length 4.1
  Top Layer w0.254: Q13.1 30.13,23.13 NOREF#3.1
HOA1: length 13.4
  Top Layer w0.254: R16.1 8.38,27.64 v1(8.66,27.64) ; v1(8.66,21.67) 8.66,19.13 10.46,17.33 U17.19
  Inner2 w0.254: v1(8.66,27.64) 9.04,27.26 9.04,22.05 v1(8.66,21.67)
HOA2: length 23
  Top Layer w0.254: v1(36.86,27.89) 37.49,27.89 38.13,27.26 39.5,27.26 R36.1 ; v1(45.11,21.42) 45.11,19 45.62,18.49 46.13,18.49 47.29,17.33 U28.19
  Inner2 w0.254: v1(45.11,21.42) 45.11,22.05 44.73,22.43 39.53,22.43 37.99,23.96 37.99,25.08 36.6,26.46 36.6,27.64 v1(36.86,27.89)
HOB1: length 14
  Top Layer w0.254: v1(12.96,21.54) 12.96,19.44 12.99,19.41 U17.16 ; v1(16.54,27.64) 16.27,27.64 R18.1
  Inner2 w0.254: v1(12.96,21.54) 13.97,22.56 16.54,22.56 16.79,22.81 16.79,27.38 v1(16.54,27.64)
HOB2: length 19.2
  Top Layer w0.254: R38.1 47.1,27.26 45.75,27.26 45.11,27.89 v1(44.35,27.89) ; U28.16 v1(49.58,21.42)
  Inner2 w0.254: v1(49.58,21.42) 49.58,23.8 49.18,24.21 44.48,24.21 43.97,24.72 43.97,27.51 v1(44.35,27.89)
HOC1: length 21.4
  Top Layer w0.254: v1(16.03,18.62) 14.63,18.62 14.49,18.47 U17.13 ; R20.1 24.1,27.85 v1(24.61,27.85)
  Inner2 w0.254: v1(24.61,27.85) 25.3,27.16 25.3,25.61 24.79,25.1 19.71,25.1 19.08,24.46 19.08,19.38 18.32,18.62 v1(16.03,18.62)
HOC2: length 16.4
  Top Layer w0.254: U28.13 51.08,18.39 51.34,18.65 v1(52.61,18.65) ; v1(51.97,28.02) 52.48,28.02 53.24,27.26 54.61,27.26 R40.1
  Inner2 w0.254: v1(52.61,18.65) 53.11,19.15 53.11,22.3 51.59,23.83 51.59,27.64 v1(51.97,28.02)
LED1: length 8.1
  Bottom Layer w0.254: U15.32 16.3,11.14 16.64,11.48 v1(16.64,14.44)
LED2: length 7.6
  Top Layer w0.254: v1(52.99,14.43) R34.2
  Bottom Layer w0.254: v1(52.99,14.43) 52.99,11.89 52.24,11.14 U22.32
LOA1: length 29.5
  Top Layer w0.254: R17.1 2.56,29.43 2.06,29.43 ; v1(17.05,17.35) 16.53,16.83 U17.11
  Inner1 w0.254: v1(2.06,29.42) 0.92,28.27 0.92,23.07 1.68,22.3 13.24,22.3 17.05,18.49 v1(17.05,17.35)
LOA2: length 21.4
  Top Layer w0.254: R37.1 v1(43.08,28) ; U28.11 53.1,16.83 v1(53.56,17.29)
  Inner1 w0.254: v1(43.08,28) 43.08,23.19 44.1,22.18 49.94,22.18 53.56,18.56 v1(53.56,17.29)
LOB1: length 28
  Top Layer w0.254: v1(17.46,16.69) 17.1,16.33 U17.10 ; R19.1 10.43,29.42 v1(9.68,29.42)
  Inner1 w0.254: v1(9.68,29.42) 7.14,29.42 6.63,28.91 6.63,23.7 7.14,23.19 13.36,23.19 17.81,18.75 17.81,17.04 v1(17.46,16.69)
LOB2: length 16.1
  Top Layer w0.254: R39.1 v1(50.83,28) ; v1(54.03,16.69) 53.68,16.33 U28.10
  Inner1 w0.254: v1(50.83,28) 51.21,27.62 51.21,21.92 54.26,18.88 54.26,16.91 v1(54.03,16.69)
LOC1: length 22.1
  Top Layer w0.254: U17.9 17.68,15.83 v1(18,16.15) ; R21.1 18.05,29.42 v1(17.43,29.42)
  Inner1 w0.254: v1(18,16.15) 18.7,16.85 18.7,18.75 14.51,22.94 14.51,28.4 15.52,29.42 v1(17.43,29.42)
LOC2: length 16.3
  Top Layer w0.254: v1(54.64,16.21) 54.26,15.83 U28.9 ; v1(57.94,26.88) 57.94,27.75 R41.1
  Inner1 w0.254: v1(54.64,16.21) 55.83,17.4 55.83,24.77 v1(57.94,26.88)
MID1: length 49.9
  Top Layer w0.254: v1(2.06,27.64) 5.61,27.64 R3.2 7.01,27.81 7.01,29.16 7.19,29.34 8.61,29.34 8.92,29.03 8.92,28.21 9.49,27.64 13.47,27.64 R5.2 14.89,27.84 14.89,29.03 15.27,29.42 16.16,29.42 16.54,29.03 16.54,28.53 17.43,27.64 21.12,27.64 R7.2
  Inner2 w0.254: v1(6.33,12.91) 4.21,12.91 3.84,13.29 3.84,22.3 1.81,24.34 1.81,27.38 v1(2.06,27.64)
  Bottom Layer w0.254: v1(6.33,12.91) 6.61,12.63 8.95,12.63 9.96,13.64 U15.27
MID2: length 44.9
  Top Layer w0.254: v1(36.73,28.91) 37.88,28.91 R23.2 39.52,28.78 45.5,28.78 R25.2 47.01,28.78 53,28.78 R27.2
  Inner2 w0.254: v1(43.21,12.78) 42.45,13.54 42.45,20.91 41.94,21.42 39.65,21.42 37.62,23.45 37.62,24.72 36.2,26.14 36.2,28.38 v1(36.73,28.91)
  Bottom Layer w0.254: U22.27 46.86,13.64 45.62,12.4 43.59,12.4 v1(43.21,12.78)
PWMAH1: length 9.5
  Top Layer w0.254: U17.22 11.32,15.83 9.68,15.83 8.79,14.94 v1(8.79,11.51)
  Bottom Layer w0.254: U15.33 10.56,10.64 10.05,11.15 9.15,11.15 v1(8.79,11.51)
PWMAH2: length 9.5
  Top Layer w0.254: U28.22 47.92,15.83 46.38,15.83 45.54,14.99 v1(45.54,11)
  Bottom Layer w0.254: v1(45.54,11) 45.91,10.64 U22.33
PWMAL1: length 5.6
  Top Layer w0.254: U17.1 11.99,12.63 12.98,11.64 v1(12.98,10.49)
  Bottom Layer w0.254: U15.34 12.63,10.14 v1(12.98,10.49)
PWMAL2: length 5.6
  Top Layer w0.254: v1(49.56,10.49) 49.56,11.64 48.58,12.61 U28.1
  Bottom Layer w0.254: U22.34 49.21,10.14 v1(49.56,10.49)
PWMBH1: length 8.8
  Top Layer w0.254: U17.23 10.2,15.33 9.44,14.57 v1(9.44,10.57)
  Bottom Layer w0.254: v1(9.44,10.57) 9.88,10.12 10.43,10.12 10.91,9.64 U15.35
PWMBH2: length 9.1
  Top Layer w0.254: v1(46.14,9.98) 46.13,9.99 46.13,14.81 46.65,15.33 U28.23
  Bottom Layer w0.254: v1(46.14,9.98) 46.48,9.64 U22.35
PWMBL1: length 6.8
  Top Layer w0.254: v1(12.98,9.6) 13.57,10.19 13.57,11.69 12.49,12.77 U17.2
  Bottom Layer w0.254: v1(12.98,9.6) 12.52,9.14 U15.36
PWMBL2: length 6.9
  Top Layer w0.254: U28.2 49.08,12.87 50.19,11.76 50.19,10.11 v1(49.56,9.48)
  Bottom Layer w0.254: U22.36 49.22,9.14 v1(49.56,9.48)
PWMCH1: length 8.3
  Top Layer w0.254: U17.24 10.46,14.83 10.07,14.44 v1(10.07,9.53)
  Bottom Layer w0.254: U15.37 10.14,9.46 v1(10.07,9.53)
PWMCH2: length 8.1
  Top Layer w0.254: v1(46.72,8.97) 46.72,14.39 47.16,14.83 U28.24
  Bottom Layer w0.254: U22.37 v1(46.72,8.97)
PWMCL1: length 12.6
  Top Layer w0.254: v1(13.01,8.68) 14.12,9.79 14.12,11.89 12.98,13.03 12.98,14.17 U17.3
  Bottom Layer w0.254: U15.38 9.64,6.72 9.93,6.43 10.57,6.43 10.82,6.68 10.82,8.08 11.08,8.33 12.66,8.33 v1(13.01,8.68)
PWMCL2: length 12.6
  Top Layer w0.254: U28.3 49.58,13.13 50.7,12.02 50.7,9.73 v1(49.56,8.59)
  Bottom Layer w0.254: v1(49.56,8.59) 49.3,8.33 47.4,8.33 47.15,8.08 47.15,6.68 46.89,6.43 46.51,6.43 46.22,6.72 U22.38
PWMIN1: length 2.7
  Top Layer w0.254: v1(8.54,9.1) R13.1
  Bottom Layer w0.254: v1(8.54,9.1) 7.39,9.1 7.14,8.85 U15.43
PWMIN2: length 2
  Bottom Layer w0.254: v1(44.6,9) 44.57,8.97 44.1,8.97 43.72,8.59 U22.43
RX1: length 18.9
  Inner1 w0.254: v1(4.5,14.53) 4.09,14.11 4.09,7.7 5.36,6.43 7.9,6.43 H1.2
  Bottom Layer w0.254: v1(4.5,14.53) 4.92,14.94 7.39,14.94 7.64,15.19 U15.19
RX2: length 15.3
  Inner1 w0.254: v1(41.05,14.68) 41.05,5.28 H3.2
  Bottom Layer w0.254: v1(41.05,14.68) 41.44,15.06 43.97,15.06 44.22,15.32 44.22,16.14 U22.19
TX1: length 20.6
  Inner1 w0.254: v1(5.17,14.11) 4.6,13.54 4.6,7.95 5.36,7.19 9.68,7.19 H1.3
  Bottom Layer w0.254: U15.20 8.14,15.05 7.67,14.58 5.64,14.58 v1(5.17,14.11)
TX2: length 16.5
  Inner1 w0.254: v1(41.65,14.21) 41.65,5.95 42.06,5.54 43.34,5.54 H3.3
  Bottom Layer w0.254: v1(41.65,14.21) 42.13,14.68 44.22,14.68 44.73,15.19 44.73,16.13 U22.20
VBA1: length 8
  Top Layer w0.254: 7.75,22.05 7.75,20.32 C16.1 7.65,20.22 7.65,18.49 8.28,17.86 9.3,17.86 10.33,16.83 U17.20
VBA2: length 8
  Top Layer w0.254: U28.20 47.03,16.83 45.88,17.99 44.73,17.99 44.13,18.59 C34.1 44.2,20.32 D7.2
VBB1: length 4.3
  Top Layer w0.254: D3.2 C17.1 11.97,20.21 11.97,19 12.49,18.48 U17.17
VBB2: length 4.3
  Top Layer w0.254: D8.2 48.65,20.31 C35.1 48.58,19.09 49.08,18.59 U28.17
VBC1: length 5.3
  Top Layer w0.254: U17.14 13.99,18.49 14.5,19 15.01,19 16.17,20.16 C18.1 16.13,20.27 D4.2
VBC2: length 5.6
  Top Layer w0.254: U28.14 50.58,18.64 50.95,19 51.84,19 52.98,20.14 C36.1 53.09,20.35 D9.2
VSA1: length 17.6
  Top Layer w0.254: v1(9.66,20.23) 11.02,18.88 11.59,18.88 11.99,18.47 U17.18
  Inner2 w0.254: v1(9.66,20.23) 8.45,20.23 7.9,20.78 7.9,27.13 4.73,30.31 v1(4.73,31.57)
  vias: v1(3.97,33.99) v1(3.97,33.23) v1(4.87,33.98) v1(4.87,33.23) v1(5.87,33.98) v1(5.87,33.23) v1(6.76,33.98) v1(6.76,33.23)
VSA2: length 22.5
  Top Layer w0.254: v1(46.13,20.25) 47.5,18.88 48.16,18.88 48.58,18.45 U28.18
  Inner2 w0.254: v1(38.75,32.49) 38.75,23.96 39.65,23.07 45.62,23.07 46.13,22.56 46.13,20.25
  vias: v1(37.55,34.32) v1(37.55,33.56) v1(38.46,34.31) v1(38.46,33.56) v1(39.46,34.31) v1(39.46,33.56) v1(40.34,34.31) v1(40.35,33.56)
VSB1: length 15.4
  Top Layer w0.254: U17.15 13.49,18.49 13.94,18.95 v1(13.94,20.23)
  Inner2 w0.254: v1(13.94,20.23) 12.77,20.23 12.22,20.78 12.22,31.23 v1(12.6,31.61)
  vias: v1(11.83,34.01) v1(11.83,33.25) v1(12.74,34) v1(12.74,33.25) v1(13.74,34) v1(13.74,33.25) v1(14.63,34) v1(14.63,33.25)
VSB2: length 18.4
  Top Layer w0.254: U28.15 50.08,18.64 50.58,19.14 v1(50.58,20.25)
  Inner2 w0.254: v1(46.25,32.57) 46.25,25.74 46.76,25.22 49.94,25.22 50.57,24.59 50.57,20.25 v1(50.58,20.25)
  vias: v1(45.3,34.47) v1(45.3,33.7) v1(46.21,34.46) v1(46.21,33.7) v1(47.21,34.46) v1(47.21,33.7) v1(48.09,34.46) v1(48.1,33.7)
VSC1: length 16.9
  Top Layer w0.254: U17.12 16.14,17.33 17.05,18.24 17.05,19.1 v1(18.17,20.23)
  Inner2 w0.254: v1(20.21,31.58) 20.21,27.88 18.17,25.84 v1(18.17,20.23)
  vias: v1(19.78,34) v1(19.78,33.23) v1(20.69,33.99) v1(20.69,33.23) v1(21.69,33.99) v1(21.69,33.23) v1(22.57,33.99) v1(22.58,33.23)
VSC2: length 17.7
  Top Layer w0.254: v1(54.98,20.25) 53.88,19.14 53.88,18.49 52.71,17.33 U28.12
  Inner2 w0.254: v1(54.98,20.25) 54.98,21.96 53.75,23.19 v1(53.75,32.58)
  vias: v1(53.05,34.57) v1(53.05,33.81) v1(53.96,34.56) v1(53.96,33.81) v1(54.96,34.56) v1(54.96,33.81) v1(55.84,34.56) v1(55.85,33.81)
$1N2415: length 4.1
  Bottom Layer w0.254: 8.81,17.94 8.64,18.11 7.14,18.11 6.14,17.12 U15.16
$1N2565: length 1.5
  Bottom Layer w0.254: C1.1 4.58,16.08 U15.13
$1N3950: length 1.7
  Top Layer w0.254: R14.1 19.78,14.44 19.83,14.39
$1N4630: length 13.2
  Top Layer w0.254: R13.2 10.58,5.54 18.95,5.54 H1.6
$2N3820: length 0.8
  Bottom Layer w0.254: 6.93,28.56 7.76,28.56 v1(7.77,28.57)
$2N3824: length 5
  Top Layer w0.254: v1(2.95,35.13) 3.19,34.89 R17.2
  Bottom Layer w0.254: 2.32,34.24 2.32,34.88 2.57,35.13 v1(2.95,35.13)
$2N3829: length 1
  Bottom Layer w0.254: 14.65,28.56 15.61,28.56 v1(15.65,28.53)
$2N3834: length 5.2
  Top Layer w0.254: v1(10.82,35.13) 11.08,34.88 R19.2
  Bottom Layer w0.254: v1(10.82,35.13) 10.31,35.13 10.01,34.83 Q4.4
$2N3839: length 0.9
  Bottom Layer w0.254: v1(23.27,28.57) 23.26,28.56 Q5.4
$2N3844: length 4.9
  Top Layer w0.254: R21.2 18.7,34.88 v1(18.44,35.13)
  Bottom Layer w0.254: Q6.4 17.96,34.9 18.19,35.13 v1(18.44,35.13)
$2N4700: length 44
  Top Layer w0.254: R15.2 14.39,7.95 10.31,7.95 9.3,8.97 9.3,9.73 8.66,10.37 5.74,10.37 5.23,10.87 5.23,13.03 6.38,14.18 6.38,22.18 6.89,22.69 9.2,22.69 D2.1 10.36,22.58 13.47,22.58 14,22.05 D3.1 14.55,22.58 17.68,22.58 D4.1 ; 15.59,9.16 15.66,9.1 ; 15.53,9.23 D1.1 15.54,10.76 C15.1 14.25,12.53 13.49,13.29 U17.4
$3N917: length 4.2
  Bottom Layer w0.254: U22.16 42.72,17.24 43.59,18.11 L2.2 C22.1
$3N919: length 1.5
  Bottom Layer w0.254: U22.13 39.78,16.14 C19.1
$3N974: length 1.7
  Top Layer w0.254: LED2.1 56.11,14.43 R34.1
$3N1144: length 9.1
  Top Layer w0.254: R42.2 46.52,5.54 50.96,5.54 H3.6
$4N1459: length 2.1
  Top Layer w0.254: v1(41.18,29.54) 40.28,29.54 R36.2
  Bottom Layer w0.254: 41.72,28.56 41.72,28.99 v1(41.18,29.54)
$4N1460: length 0.9
  Bottom Layer w0.254: Q8.4 42.17,29.57 v1(42.15,29.55)
$4N1461: length 2.2
  Top Layer w0.254: v1(48.92,29.54) 47.88,29.54 R38.2
  Bottom Layer w0.254: Q9.4 49.25,29.22 v1(48.92,29.54)
$4N1462: length 0.9
  Bottom Layer w0.254: Q10.4 50,30.31 v1(50,29.55)
$4N1463: length 2.2
  Top Layer w0.254: v1(56.67,29.54) 55.64,29.54 55.61,29.51
  Bottom Layer w0.254: Q11.4 56.92,29.29 v1(56.67,29.54)
$4N1464: length 0.9
  Bottom Layer w0.254: v1(57.69,29.51) 57.69,30.38 Q12.4
$4N1481: length 43.9
  Top Layer w0.254: D9.1 54.64,22.58 51.25,22.58 D8.1 50.2,22.58 46.81,22.58 D7.1 45.65,22.69 43.34,22.69 42.57,21.92 42.57,13.54 41.68,12.65 41.68,10.75 42.19,10.24 44.99,10.24 45.62,9.6 45.62,8.72 46.38,7.95 50.33,7.95 R35.2 51.72,9.36 D6.1 51.73,10.89 C33.1 50.83,12.65 50.08,13.4 U28.4

## Copper pours and planes (outline as drawn; the poured copper is in the pictures)
GND on Top Layer: 0.03,41.1 60.1,41.1 60.1,-0.05 0.03,-0.05
GND on Bottom Layer: 0.03,41.48 60.1,41.48 60.1,0.02 0.03,0.02
GND on Inner1: 0.03,41.48 60.1,41.48 60.1,-0.05 0.03,-0.05
GND on Inner2: 0.03,41.48 60.1,41.48 60.1,-0.05 0.03,-0.05
VBAT on Top Layer: 28.48,26.75 28.86,26.37 28.86,25.29 29.39,24.75 29.39,23.18 29.68,22.9 29.68,21.6 29.62,21.54 28.73,21.54 28.6,21.67 28.6,22.94 28.48,23.07 28.09,23.07 27.97,23.19 27.97,24.84 27.84,24.97 26.95,24.97 26.82,25.1 26.82,26.62 26.95,26.75
VBAT on Bottom Layer: 27.96,7.7 33.18,12.91 33.18,23.45 33.56,23.83 36.1,23.83 37.62,22.3 57.18,22.3 57.31,22.43 57.31,27.13 57.18,27.26 2.82,27.26 2.69,27.13 2.69,22.44 2.83,22.3 22.63,22.3 24.16,23.83 26.44,23.83 26.7,23.57 26.7,12.65 26.32,12.27 25.05,12.27 24.28,11.51 24.28,7.89 24.48,7.7
VCC12V on Top Layer: 32.37,19.26 32.55,19.07 32.55,17.97 32.67,17.86 33.94,17.86 34.06,17.99 34.06,20.78 33.94,20.91 29.75,20.91 29.62,20.78 29.62,19.38 29.75,19.26
VSA1 on Bottom Layer: 3.58,41.23 3.46,41.1 3.46,29.42 3.2,29.16 2.82,29.16 2.69,29.03 2.69,28.02 2.82,27.89 6,27.89 6.12,28.02 6.12,29.04 7.14,30.05 8.16,30.05 8.28,30.18 8.28,41.1 8.16,41.23
VSA1 on Inner1: 3.46,41.23 8.28,41.23 8.28,32.84 3.46,32.84
VSA1 on Inner2: 3.46,41.23 8.28,41.23 8.28,32.84 3.46,32.84
VSA2 on Bottom Layer: 40.74,27.96 40.79,28.02 40.79,41.1 40.54,41.35 36.29,41.35 35.79,40.86 35.79,30.23 35.97,30.05 37.28,30.05 37.49,29.83 37.49,28.15 37.68,27.96
VSA2 on Inner1: 36.1,41.61 40.92,41.61 40.92,33.23 36.1,33.23
VSA2 on Inner2: 36.1,41.61 40.92,41.61 40.92,33.23 36.1,33.23
VSB1 on Bottom Layer: 16.28,41.1 16.16,41.23 11.59,41.23 11.46,41.1 11.46,29.42 11.2,29.16 10.57,29.16 10.44,29.03 10.44,28.02 10.57,27.89 13.62,27.89 13.74,28.02 13.74,29.11 14.69,30.05 16.16,30.05 16.28,30.18
VSB1 on Inner1: 11.46,41.23 16.28,41.23 16.28,32.84 11.46,32.84
VSB1 on Inner2: 11.46,41.23 16.28,41.23 16.28,32.84 11.46,32.84
VSB2 on Bottom Layer: 48.29,28.02 48.41,28.15 48.41,29.92 48.54,30.05 48.54,40.72 48.03,41.23 44.1,41.23 43.72,40.85 43.72,29.92 43.84,29.8 44.73,29.8 44.99,29.54 44.99,28.15 45.11,28.02
VSB2 on Inner1: 43.72,41.23 48.54,41.23 48.54,33.35 43.72,33.35
VSB2 on Inner2: 43.72,41.23 48.54,41.23 48.54,33.23 43.72,33.23
VSC1 on Bottom Layer: 21.49,28.02 21.62,28.15 21.62,29.09 22.46,29.94 24.04,29.94 24.16,30.05 24.16,40.85 23.78,41.23 19.59,41.23 19.21,40.85 19.21,29.29 19.1,29.18 18.33,29.18 18.19,29.03 18.19,28.15 18.32,28.02
VSC1 on Inner1: 19.33,41.23 24.16,41.23 24.16,32.84 19.33,32.84
VSC1 on Inner2: 19.33,41.23 24.16,41.23 24.16,32.84 19.33,32.84
VSC2 on Bottom Layer: 55.91,27.89 56.03,28.02 56.03,29.67 56.42,30.05 56.42,40.97 56.16,41.23 51.72,41.23 51.46,40.97 51.46,29.92 51.72,29.67 52.61,29.67 52.73,29.54 52.73,28.02 52.86,27.89
VSC2 on Inner1: 51.46,41.23 56.42,41.23 56.42,33.35 51.46,33.35
VSC2 on Inner2: 51.46,41.23 56.42,41.23 56.42,33.35 51.46,33.35
$2N2044 on Top Layer: 34.05,16.11 32.22,17.94 29.02,17.94 28.33,17.25 26.72,17.25 26.57,17.1 26.57,16.33 26.7,16.21 28.38,16.21 28.98,15.61 32.34,15.61 32.55,15.39 32.55,14.55 32.67,14.43 33.92,14.43 34.05,14.56

Small or netless copper shapes (teardrops, artwork), in the pictures only: 241 on Top Layer, 121 on Bottom Layer, 20 on Inner1, 40 on Inner2

## Text on the board
Top Layer: 20th Origin | 2025/4/1 | 华东理工大学
Top Solder Mask Layer: 20th Origin | 2025/4/1 | 华东理工大学
Top Silkscreen Layer: PWM | 5V | RX | TX | GND | OFF | ON
